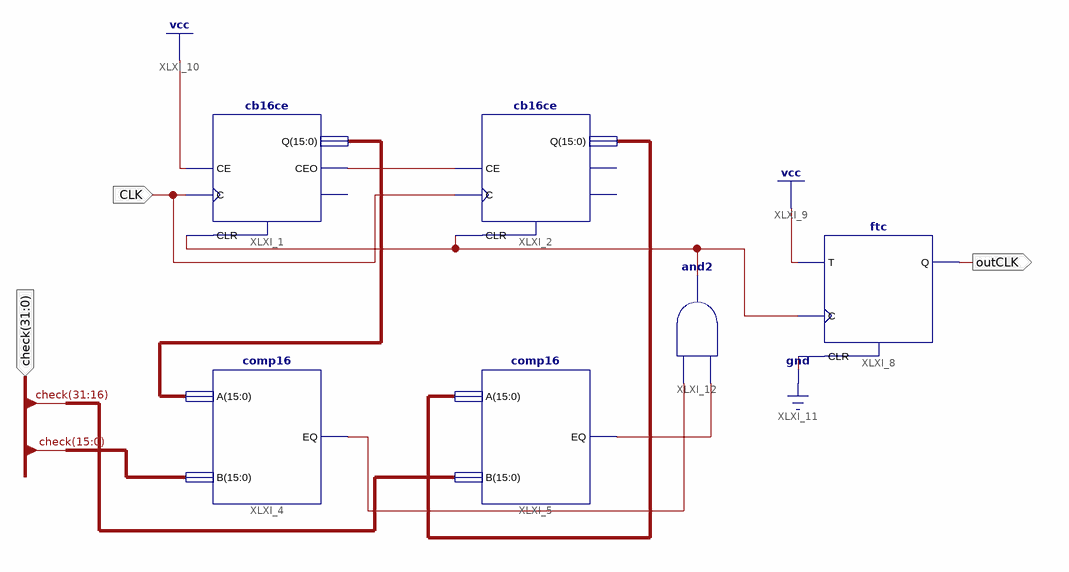
[diagram p0: schematic sheet 1]
// Xilinx ISE schematic ClockDiv_MANGPOR.sch (spartan6) as structural Verilog: 6 symbols, 3 ports
module ClockDiv_MANGPOR (
  input  CLK,
  input  [31:0] check,
  output outCLK
);

  wire XLXN_22, XLXN_23, XLXN_24, XLXN_26;
  wire [15:0] XLXN_1, XLXN_2;

  cb16ce XLXI_1 (.C(CLK), .CE(1'b1), .CLR(XLXN_24), .CEO(XLXN_26), .Q(XLXN_1));  // open: TC
  cb16ce XLXI_2 (.C(CLK), .CE(XLXN_26), .CLR(XLXN_24), .Q(XLXN_2));  // open: CEO, TC
  comp16 XLXI_4 (.A(XLXN_1), .B(check[15:0]), .EQ(XLXN_22));
  comp16 XLXI_5 (.A(XLXN_2), .B(check[31:16]), .EQ(XLXN_23));
  ftc XLXI_8 (.C(XLXN_24), .CLR(1'b0), .T(1'b1), .Q(outCLK));
  and XLXI_12 (XLXN_24, XLXN_23, XLXN_22);
endmodule
